# EAGLE design Wattuino-Nanite85_v10 (EAGLE 7.5.0)
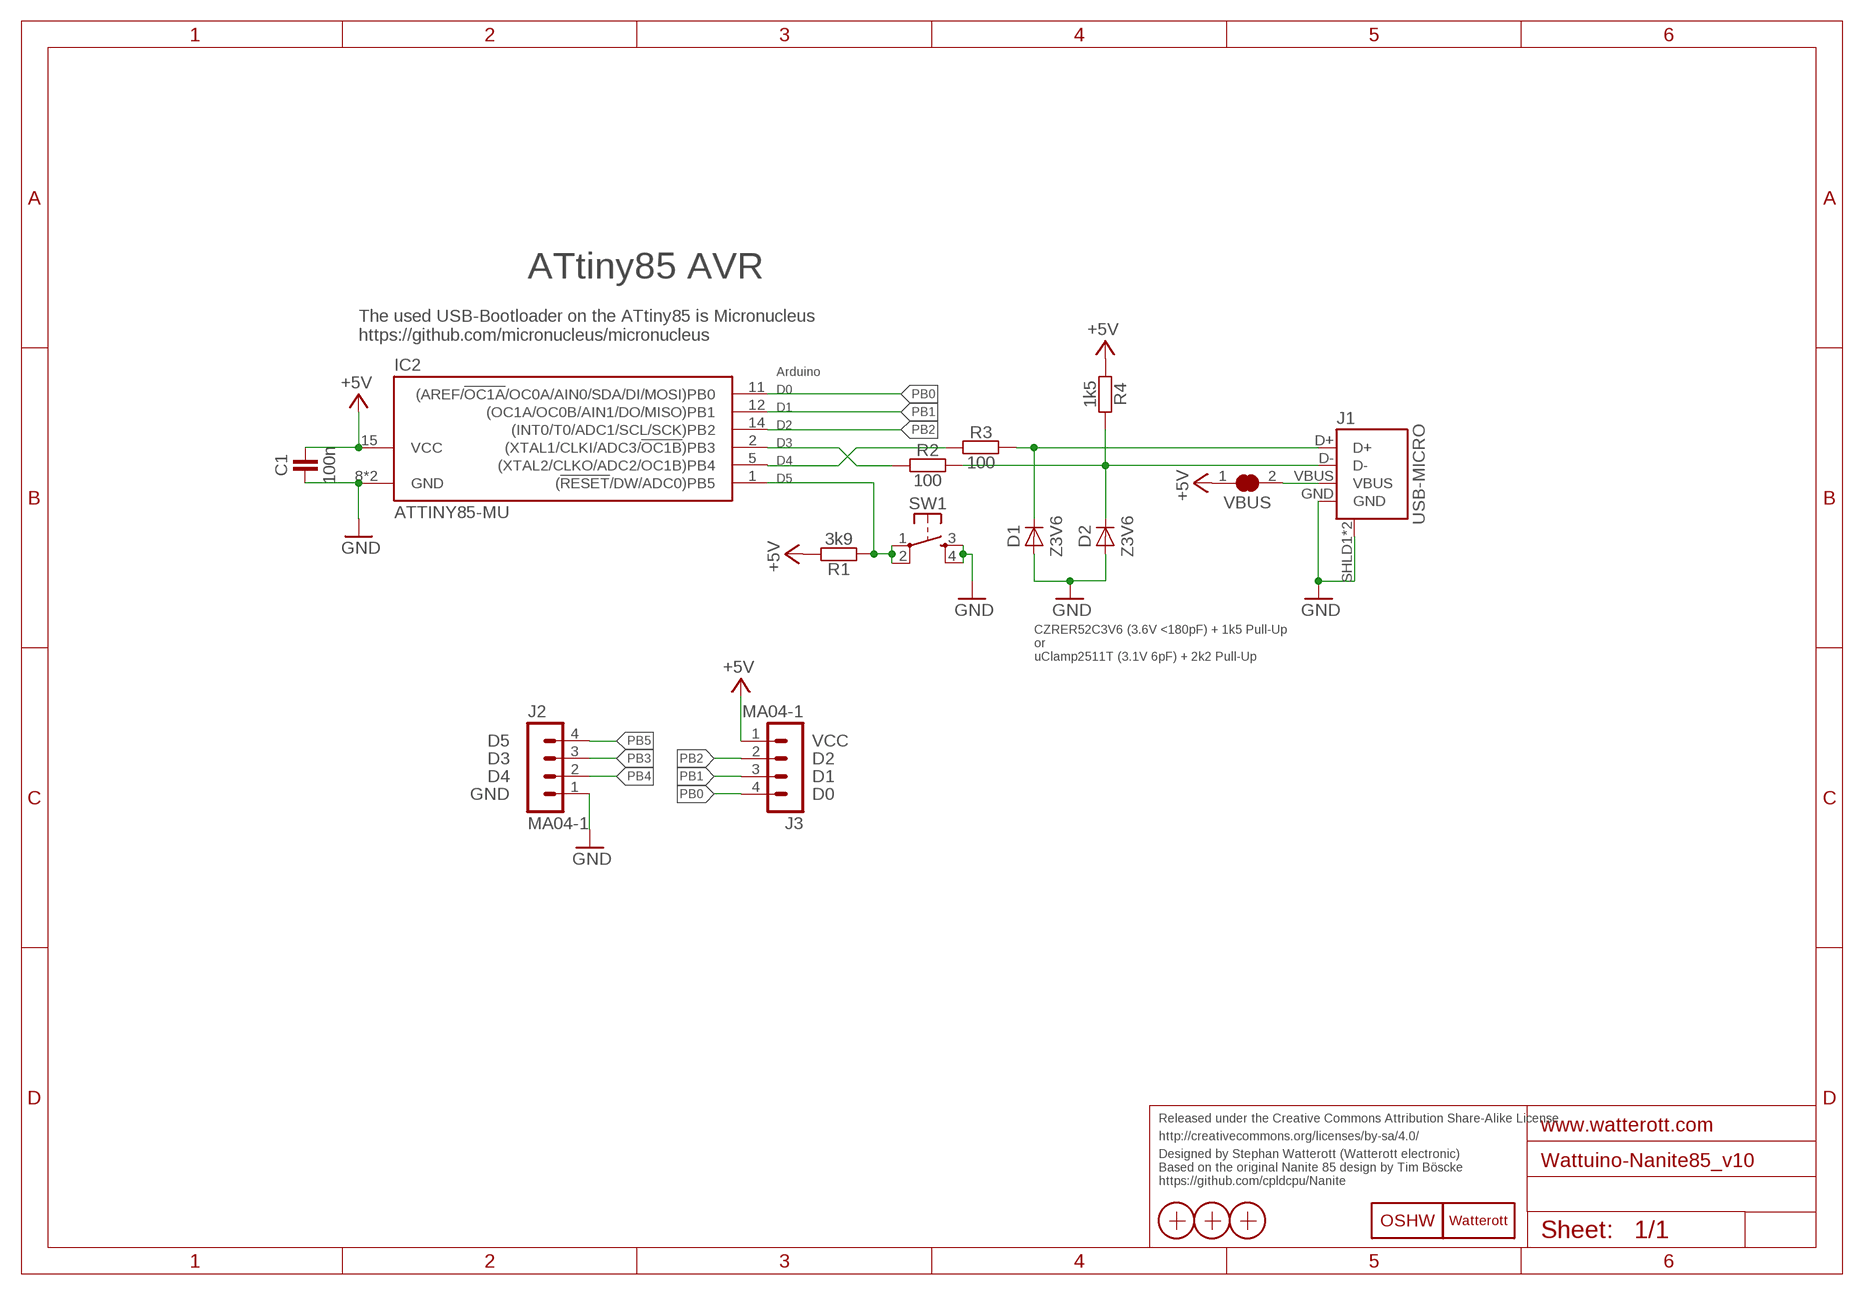
[diagram p0: schematic, sheet 1]

## Parts
C1  100n  CAPACITOR-0402  [C0402]
D1  Z3V6  DIODE-SOD882  [SOD882]
D2  Z3V6  DIODE-SOD882  [SOD882]
IC2  ATTINY85-MU  [QFN20-PAD]
J1  USB-MICRO  [USB-MICRO-10103594]
J2  MA04-1  [MA04-1]
J3  MA04-1  [MA04-1]
LOGO1  LOGO-S_PLACE_S  [SPARK_TPLACE_S]
LOGO2  OSHW_LOGOX0070  [OSHW_6X70]
R1  3k9  RESISTOR-0402  [C0402]
R2  100  RESISTOR-0402  [C0402]
R3  100  RESISTOR-0402  [C0402]
R4  1k5  RESISTOR-0402  [C0402]
SW1  SW-TACTILE-PTS840P  [SW_PTS840P]
VBUS  JUMPER2-0603-NC  [JUMPER2-0603_NC]
X1  PASSER-07  [PASSER_07MM]
X2  PASSER-07  [PASSER_07MM]
X3  PASSER-07  [PASSER_07MM]

## Nets
+5V: C1.2 IC2.15(VCC) J3.1 R1.2 R4.1 VBUS.1
D_N: D2.C J1.D- R2.2 R4.2
D_P: D1.C J1.D+ R3.2
GND: C1.1 D1.A D2.A IC2.8(GND) IC2.TP(GND) J1.GND J1.SHLD1(SHIELD) J1.SHLD2(SHIELD) J2.1 SW1.3(S1) SW1.4(S2)
PB0: IC2.11((AREF/!OC1A!/OC0A/AIN0/SDA/DI/MOSI)PB0) J3.4
PB1: IC2.12((OC1A/OC0B/AIN1/DO/MISO)PB1) J3.3
PB2: IC2.14((INT0/T0/ADC1/SCL/SCK)PB2) J3.2
PB3: IC2.2((XTAL1/CLKI/ADC3/!OC1B!)PB3) J2.3 R2.1
PB4: IC2.5((XTAL2/CLKO/ADC2/OC1B)PB4) J2.2 R3.1
PB5: IC2.1((!RESET!/DW/ADC0)PB5) J2.4 R1.1 SW1.1 SW1.2
VBUS: J1.VBUS VBUS.2

## Notes on the sheet
- ATtiny85 AVR
- The used USB-Bootloader on the ATtiny85 is Micronucleus 
  https://github.com/micronucleus/micronucleus
- Arduino
- D0
- D1
- D2
- D3
- D4
- D5
- CZRER52C3V6 (3.6V <180pF) + 1k5 Pull-Up 
  or
  uClamp2511T (3.1V 6pF) + 2k2 Pull-Up
- D5 | VCC
- D3 | D2
- D4 | D1
- GND | D0
- Released under the Creative Commons Attribution Share-Alike License
- http://creativecommons.org/licenses/by-sa/4.0/
- Designed by Stephan Watterott (Watterott electronic)
  Based on the original Nanite 85 design by Tim Böscke
  https://github.com/cpldcpu/Nanite

## Library data of the parts
C1 = we-rcl:CAPACITOR: Capacitors ...4.7uF @ 6.3V -> 0402 ...10uF @ 16V -> 0603 ...22uF @ 25V -> 0805
D1 D2 = we-rcl:DIODE: Diodes
IC2 = we-chip:ATTINY85: Atmel ATtiny25/45/85 AVR Microcontroller; DIGIKEY: ATTINY85-20MURDKR-ND
J1 = we-con:USB: USB Connectors; DIGIKEY: 609-4050-6-ND
J2 J3 = we-con:MA04-1: Pin Header
LOGO1 = we-symbol:LOGO: Watterott electronic Logo
LOGO2 = we-symbol:OSHW_LOGO: Open-Source-Hardware Logo
R1-R4 = we-rcl:RESISTOR: Resistors all kinds in 0603 and 0402
SW1 = we-switch:SW-TACTILE: Tactile Switches; DIGIKEY: CKN10511DKR-ND
VBUS = we-rcl:JUMPER2: 2 Pin Jumpers
X1-X3 = we-symbol:PASSER: Fiducial Markers

## Board
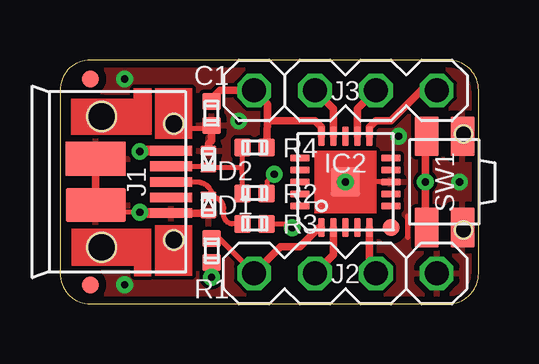
[diagram p1: board, top side]
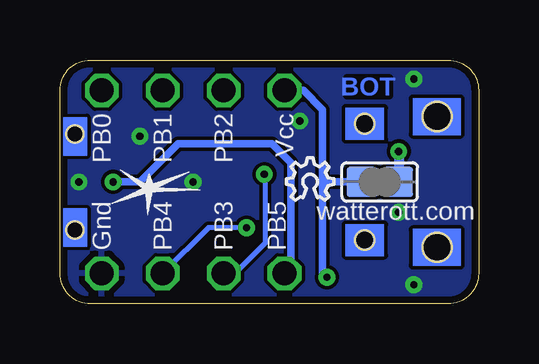
[diagram p2: board, bottom side, seen from below]

Size 17.46 x 10.16 mm. Coordinates in mm from the lower left corner, seen from the top.
Outline: 0,1.27 arc90 1.27,0 16.19,0 arc90 17.46,1.27 17.46,8.89 arc90 16.19,10.16 1.27,10.16 arc90 0,8.89 0,1.27
Copper layers (1*16): Top 0.035mm / dielectric 1.5mm / Bottom 0.035mm
Design rules "we-dru *": minimum track width 0.15mm, minimum drill 0.3mm, track to track 0.15mm, track to pad 0.15mm, pad to pad 0.15mm, via to via 0.15mm, smd to smd 0.1mm, copper to edge 0.3mm, drill to drill 0.2mm, minimum pad ring 0.18mm, minimum via ring 0.2mm, stop-mask expansion 0.1mm, vias tented up to drill 0.5mm, thermal gap 0.25mm

### Footprints (pad centres in the part's own frame; a part is rotated, then mirrored left to right if it is on the bottom)
C0402 = smd 0.75 x 0.7: 1 0,0.5; 2 0,-0.5
SOD882 = smd 0.65 x 0.4: A 0,-0.35; C 0,0.35
QFN20-PAD = smd 0.8 x 0.28: 1 -1.9,1; 2 -1.9,0.5; 3 -1.9,0; 4 -1.9,-0.5; 5 -1.9,-1; 11 1.9,-1; 12 1.9,-0.5; 13 1.9,0; 14 1.9,0.5; 15 1.9,1 | smd 0.28 x 0.8: 6 -1,-1.9; 7 -0.5,-1.9; 8 0,-1.9; 9 0.5,-1.9; 10 1,-1.9; 16 1,1.9; 17 0.5,1.9; 18 0,1.9; 19 -0.5,1.9; 20 -1,1.9 | smd 1.2 x 1.2: TP 0,0
USB-MICRO-10103594 = smd 1.8 x 0.4: D+ -2.885,0; D- -2.885,-0.65; GND -2.885,1.3; ID -2.885,0.65; VBUS -2.885,-1.3 | smd 2.5 x 1.425: SHLD1 0.25,-0.963; SHLD2 0.25,0.963 | hole 0.8: -3,2.425; -3,-2.425 | hole 1.2: 0.01,2.725; 0.01,-2.725
MA04-1 = drill 1 octagon: 1 0,3.81; 2 0,1.27; 3 0,-1.27; 4 0,-3.81
SW_PTS840P = smd 1.65 x 1: 1 -1.9,0.75; 2 1.9,0.75; 3 -1.9,-0.75; 4 1.9,-0.75 | hole 0.7: -2,-0.8; 2,-0.8
JUMPER2-0603_NC = smd 1.25 x 1.25: 1 0,0.76; 2 0,-0.76
PASSER_07MM = smd 0.7 x 0.7: X 0,0

### Placement (x,y rotation side)
C1  6.32,7.94 180 top
D1  6.19,4.13 0 top
D2  6.19,6.03 180 top
IC2  11.91,5.08 90 top
J1  1.75,5.08 180 top
J2  11.91,1.27 270 top
J3  11.91,8.89 90 top
LOGO1  13.72,4.79 0 bottom
LOGO2  8.02,4.32 0 bottom
R1  6.32,2.22 0 top
R2  8.12,4.6 270 top
R3  8.12,3.33 270 top
R4  8.12,6.51 270 top
SW1  16.03,5.08 90 top
VBUS  4.13,5.08 90 bottom
X1  1.27,0.79 0 top
X2  1.27,9.37 0 top
X3  13.81,3.17 0 top

### Tracks (layer width: path | path; a pad name or v marks a point on that pad's centre or on a via)
+5V  (via drill 0.3)
  Top 0.203: 8.08,8.9 J3.1
  Top 0.305: C1.2 6.37,8.59 6.67,8.89 J3.1 8.66,8.32 8.66,7.62 | IC2.15 10.91,7.35 10.64,7.62 8.66,7.62 | R1.2 v6.33,1.11 | R4.1 8.66,7.62
  Bottom 0.305: 6.51,5.08 6.51,1.27 6.35,1.11 v6.33,1.11 | 6.51,5.08 6.51,8.1 7.3,8.89 J3.1 | VBUS.1 6.51,5.08
D_N
  Top 0.203: J1.D- 6.14,5.73 D2.C 7.57,5.68 | 7.57,5.68 R2.2 | R4.2 7.57,5.68
D_P
  Top 0.203: R3.2 7.16,3.33 arc-90 6.83,3.81 6.83,3.97 arc90 6.35,4.45 | J1.D+ 5.71,5.08 arc-90 6.35,4.45 | 6.35,4.45 6.22,4.45 D1.C
GND  (via drill 0.3)
  Top 0.203: 6.17,3.76 D1.A | IC2.8 IC2.TP | v3.33,3.81 1.8,3.81 J1.SHLD2 | 5.14,7.3 6.03,7.3 6.19,7.3 6.24,7.3 C1.1 | 14.5,3.65 14.5,2.76
  Top 0.305: J1.SHLD2 J1.SHLD1 | C1.1 6.33,6.8 6.19,6.67 D2.A | 3.36,3.78 v3.33,3.81 | J1.GND D1.A
  Top 0.406: J1.GND 3.36,3.78
  other vias: 16.67,5.08 7.46,7.62 11.91,5.08 2.7,0.79 2.7,9.37 14.13,6.99
  pour Top: 0,0 17.46,0 17.46,10.16 0,10.16
  pour Bottom: 0,0 17.46,0 17.46,10.16 0,10.16
PB0
  Top 0.305: IC2.11 12.91,7.35 13.18,7.62 13.81,7.62 15.08,8.89 J3.4
PB1
  Top 0.305: IC2.12 12.41,8.12 J3.3
PB2
  Top 0.305: IC2.14 11.41,8.12 J3.2
PB3  (via drill 0.3)
  Top 0.203: R2.1 8.66,5.12 v8.94,5.4
  Top 0.305: IC2.2 11.41,2.04 J2.3
  Bottom 0.203: J2.3 10.16,1.27 8.89,2.54 8.89,5.35 v8.94,5.4
PB4  (via drill 0.3)
  Top 0.203: R3.1 9.53,3.33 v9.68,3.17
  Top 0.305: IC2.5 12.91,1.54 J2.2
  Bottom 0.203: v9.68,3.17 11.27,3.17 J2.2
PB5  (via drill 0.3)
  Top 0.203: 15.24,3.22 SW1.1 | 15.24,6.94 SW1.2 | R1.1 6.49,2.87 J2.4
  Top 0.305: J2.4 9.21,2.38 10,2.38 10.8,3.18 IC2.1 | 15.24,3.22 v15.24,5.08 15.24,6.94
  Bottom 0.305: v15.24,5.08 14.13,5.08 12.54,6.67 8.62,6.67 7.83,5.87 7.83,1.54 J2.4
VBUS  (via drill 0.3)
  Top 0.406: J1.VBUS 3.36,6.38 v3.33,6.35
  Bottom 0.203: 4.73,5.08 VBUS.2 3.33,5.08
  Bottom 0.406: v3.33,6.35 3.33,5.11 VBUS.2

### Text on the board
Bottom: BOT
bPlace: Vcc | PB2 | PB1 | PB0 | watterott.com | PB5 | PB3 | PB4 | Gnd
Reference: Silkscreen: 22 bPlace